# Altium schematic sheet Sheet1.SchDoc
size 431 x 279 mm; SheetNumber: 1; SheetTotal: 1; ENG_APP_DATE: --/--/--; DSN_APP_DATE: --/--/--; CHK_APP_DATE: --/--/--
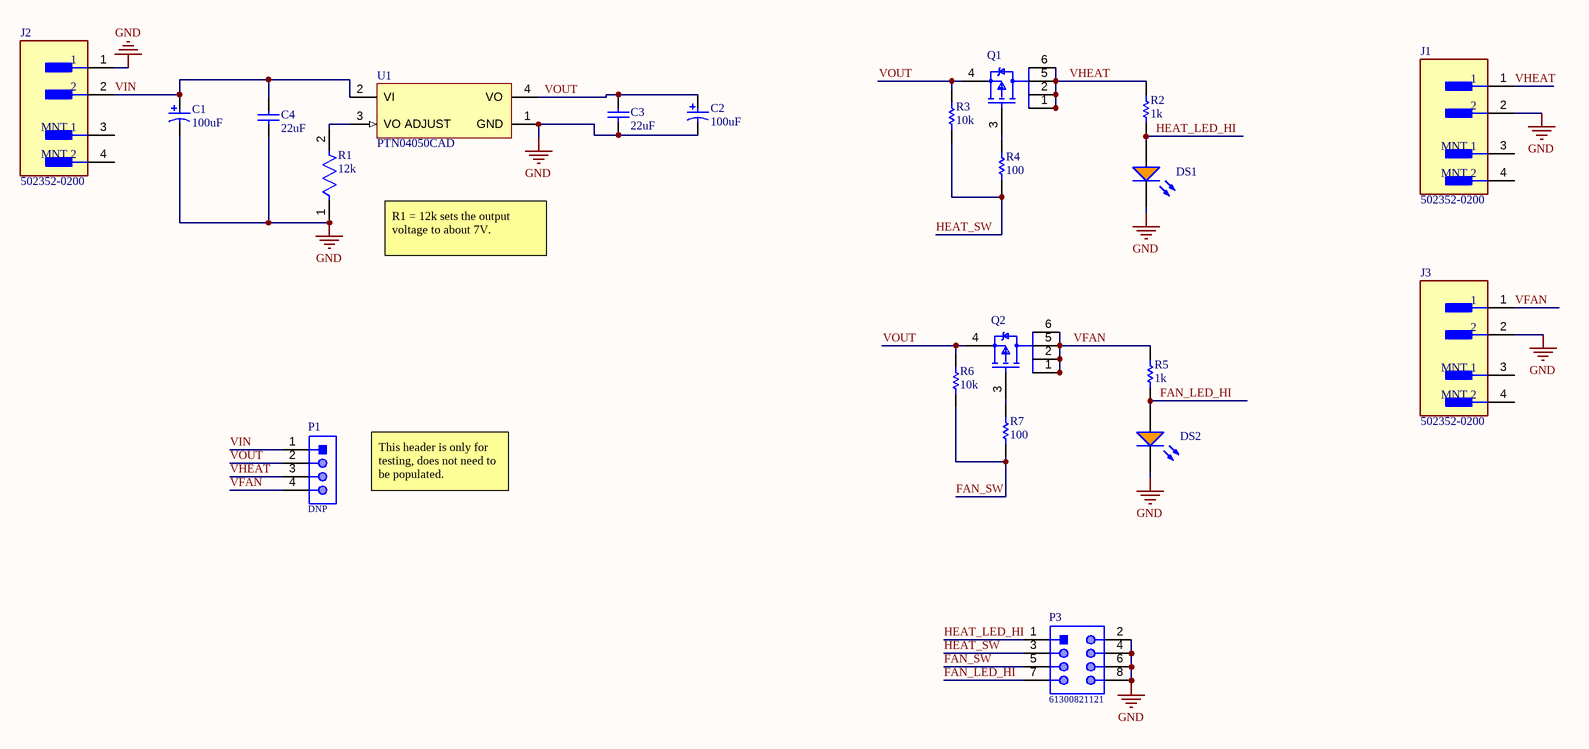
[diagram p0: Sheet1.SchDoc]

## Parts
C1  100uF  [PNSC-FK-V-D8_V]
C2  100uF  [PNSC-FK-V-D8_V]
C3  22uF  [MURA-1210_H_2.7_L]
C4  22uF  [MURA-1210_H_2.7_L]
DS1  HSMD-C170  [AVAG-HSMX-C170_V]  (value not drawn)
DS2  HSMD-C170  [AVAG-HSMX-C170_V]  (value not drawn)
J1  502352-0200  [FP-502352-0200-MFG]
J2  502352-0200  [FP-502352-0200-MFG]
J3  502352-0200  [FP-502352-0200-MFG]
P1  DNP  [61300411121]
P3  61300821121  [61300821121]
Q1  SI3493DDV-T1-GE3  [FP-C-06593-MFG]  (value not drawn)
Q2  SI3493DDV-T1-GE3  [FP-C-06593-MFG]  (value not drawn)
R1  12k  [FP-CRCW0805-e3-IPC_A]
R2  1k  [RESC2013X55X40LL15T20]
R3  10k  [RESC2013X60X35NL10T20]
R4  100  [RESC2013X50X30LL20T20]
R5  1k  [RESC2013X55X40LL15T20]
R6  10k  [RESC2013X60X35NL10T20]
R7  100  [RESC2013X50X30LL20T20]
U1  PTN04050CAD  [EUU0004A]

## Nets
GND: C1.2 C2.2 C3.1 C4.2 DS1.2(K) DS2.2(K) J1.2 J2.1 J3.2 P3.2 P3.4 P3.6 P3.8 R1.1 U1.1(GND)
FAN_LED_HI: DS2.1(A) P3.7 R5.1
FAN_SW: P3.5 R6.2 R7.1
HEAT_LED_HI: DS1.1(A) P3.1 R2.1
HEAT_SW: P3.3 R3.2 R4.1
VFAN: J3.1 P1.4 Q2.1(D) Q2.2(D) Q2.5(D) Q2.6(D) R5.2
VHEAT: J1.1 P1.3 Q1.1(D) Q1.2(D) Q1.5(D) Q1.6(D) R2.2
VIN: C1.1 C4.1 J2.2 P1.1 U1.2(VI)
VOUT: C2.1 C3.2 P1.2 Q1.4(S) Q2.4(S) R3.1 R6.1 U1.4(VO)
NetQ1_3: Q1.3(G) R4.2
NetQ2_3: Q2.3(G) R7.2
NetR1_2: R1.2 U1.3(VO_ADJUST)

Not connected (* = marked no-connect by the designer): J1 3(MNT_1) 4(MNT_2); J2 3(MNT_1) 4(MNT_2); J3 3(MNT_1) 4(MNT_2)

## Notes on the sheet
- R1 = 12k sets the output voltage to about 7V.
- This header is only for testing, does not need to be populated.
- DWG. NO.
- REV.
- SHT.
- THIS DOCUMENT AND THE DATA DISCLOSED HEREIN OR HEREWITH IS THE PROPERTY OF ALTIUM LIMITED AND MAY BE FREELY DISTRIBUTED IN WHOLE. NO RIGHTS ARE RESERVED OR EXPRESS OR IMPLIED WARANTEE GIVEN.
- REVISION
- DESCRIPTION
- DATE
- APPROVED
- ENG:
- APPROVALS
- PROJECT
- DSN:
- CHK:
- REFERENCE DOCUMENTS
- PROJECT REVISION:
- TITLE
- DOCUMENT REVISION:
- DESIGN ITEM:
- BOM:
- FAB DWG:
- PCB DWG:
- ASSY DWG:
- SCALE:
- SIZE
- B
- CAGE CODE
- FILE NAME
- DWG NO.
- SHEET
- OF
- REV

## Library data of the parts
C1 C2 = CMP-2000-06206-1: Aluminum Electrolytic Capacitor, 100 uF, +/- 20%, 25 V, 2-Pin SMD (Size Code D8), -55 to 105 degC, RoHS, Tape and Reel; Manufacturer: Panasonic; Type: Can; Lifetime@Temperature: 2000Hrs@105°C; Capacitance: 100µF; Rated Voltage: 25V; Ripple Current: 280mA; Impedance: 0.34O; Case Size/Dimension: Ø6.3x7.7mm; Operating Temp-Max: 105°C; Series: FK; Package URL: http://industrial.panasonic.com/cdbs/www-data/pdf/RDE0000/DME0000COL48.pdf; Mounting Technology: SurfaceMount; Package Description: 2-Pin Electrolytic Aluminum Capacitor, Body 6.6 x 6.6 mm; Datasheet Version: 03/2016; Datasheet URL: http://industrial.panasonic.com/cdbs/www-data/pdf/RDE0000/ABA0000C1181.pdf; Manufacturer URL: http://www.panasonic.com/; Package Reference: FK-V-D8; Operating Temp Range: -55to+105°C
C3 C4 = CMP-2000-06361-1: Chip Monolithic Ceramic Capacitor, 22 uF, +/- 10%, -55 to 85 degC, 2-Pin SMD (1210), RoHS, Tape and Reel; Manufacturer: Murata; Product Training Modules: High-CapMultilayerCeramicCapacitors; Other Names: 490-1882-2; Online Catalog: GRMSeries; Voltage Rating DC: 16V; Temperature Coefficient: X5R; Capacitance: 22µF; Catalog Drawings: GRMSeries_1210_2.5; Featured Product: GA3SafetyRecognizedCapsandHi-CapMLCC; Applications: GeneralPurpose; Lead Spacing: -; Ratings: -; Standard Package: 1,000; Lead Style: -; Size / Dimension: 0.126"Lx0.098"W(3.20mmx2.50mm); Features: -; Thickness (Max): 0.106"(2.70mm); Package Description: 2-Pin Surface Mount Device, Body 3.2 x 2.5 mm; Series: GRM; Mounting Type: SurfaceMount,MLCC; Category: Capacitors; Package / Case: 1210(3225Metric); Datasheet Version: 05/2014; Datasheet URL: https://datasheet.ciiva.com/26915/getdatasheetpartid-88858-26915376.pdf; Mounting Technology: SurfaceMount; Package Reference: 1210; Tolerance: ±10%; Packaging: Tape&Reel(TR); Operating Temperature: -55°C~85°C; Voltage - Rated: 16V; Height - Seated (Max): -; Family: CeramicCapacitors; Manufacturer URL: http://www.murata.com/
DS1 DS2 = CMP-2000-06421-1: LED Uni-Color Orange, 52 mW, 20 mA, -40 to 85 degC, 2-Pin SMD, RoHS, Tape and Reel; Manufacturer: Avago; Forward Current If Max: 20mA; External Length / Height: 2mm; Luminous Intensity: 8mcd; Lens Shape: Rectangular; Bulb Size: 1.25mmx1.4mm; External Width: 1.25mm; Wavelength Typ: 605nm; Dominant Wavelength: 604nm; PIV Max: 5V; Opto Mounting Orientation: Top; Viewing Angle: 170°; LED Type: Standard; Forward Voltage: 2.2V; SVHC: NoSVHC(19-Dec-2012); No. of Pins: 2; External Depth: 0.8mm; Power Dissipation Pd: 52mW; Storage Temperature Max: 85°C; Package Description: 2-Pin Surface Mount Device, Body 2 x 1.25 mm, Height 0.8 mm; MSL: MSL2A-4weeks; Operating Temperature Range: -30°Cto+85°C; Datasheet URL: http://docs.avagotech.com/docs/AV02-0551EN; Manufacturer URL: http://www.avagotech.com/; Operating Temperature Min: -30°C; Light Area Height: 1.25mm; Mounting Technology: SurfaceMount; Storage Temperature Min: -40°C; LED Mounting: SMD; Peak Wavelength: 605nm; Package / Case: SMD; Peak Forward Current: 20mA; Forward Voltage VF Max: 2.2V; Mounting Type: SMD; LED Colour: Orange; Forward Current If: 20mA; Operating Temperature Max: 85°C; Voltage Vf Typ: 2.2V; Package Reference: HSMX-C170; Datasheet Version: 03/2012; Opto Case Style: SMD; Luminous Intensity Typ: 8mcd
J1 J3 = CMP-04776-000115-1: CONN HEADER SMD R/A 2POS 2MM; Manufacturer: Molex; Number Of Contacts: 2; Current Rating: 3A; Conn Gender: Male; Conn Orientation: Right Angle; Voltage Rating: 125V; Temperature Range Low: -40°C; Ambient Temperature Range High: +105°C; Height: 6.6mm; Pitch: 2mm; Temperature Range High: +105°C; ComponentLink2URL: https://www.molex.com/webdocs/datasheets/pdf/en-us/5023520200_PCB_HEADERS.pdf; Device Class L2: Headers and Wire Housings; Contact Material: Tin,Nickel; Manufacturer Part Number: 502352-0200; Category: Conn; RoHS: TRUE; Ambient Temperature Range Low: -40°C; ComponentLink2Description: Datasheet; Digikey Description: CONN HEADER SMD R/A 2POS 2MM; Package: 502352-0200; Mouser Description: DuraClik™ Wire-to-Board Header, Single Row, Right Angle, 2 Circuits, Tin (Sn); Automotive: No; Lead Free: Yes; Octopart: https://octopart.com/502352-0200-molex-9519058; Number Of Rows: 1; Temperature: -40°C to +105°C; Device Class L1: Connectors; Device Class L3: unset; Footprint Url: https://www.molex.com/pdm_docs/sd/5023520200_sd.pdf
J2 = CMP-04776-000115-1: CONN HEADER SMD R/A 2POS 2MM; Manufacturer: Molex; Number Of Contacts: 2; Current Rating: 3A; Conn Gender: Male; Conn Orientation: Right Angle; Voltage Rating: 125V; System: Connector; Temperature Range Low: -40°C; Ambient Temperature Range High: +105°C; Height: 6.6mm; Pitch: 2mm; Temperature Range High: +105°C; ComponentLink2URL: https://www.molex.com/webdocs/datasheets/pdf/en-us/5023520200_PCB_HEADERS.pdf; Device Class L2: Headers and Wire Housings; Contact Material: Tin,Nickel; Manufacturer Part Number: 502352-0200; Category: Conn; RoHS: TRUE; Ambient Temperature Range Low: -40°C; ComponentLink2Description: Datasheet; Digikey Description: CONN HEADER SMD R/A 2POS 2MM; Package: 502352-0200; Mouser Description: DuraClik™ Wire-to-Board Header, Single Row, Right Angle, 2 Circuits, Tin (Sn); Automotive: No; Lead Free: Yes; Octopart: https://octopart.com/502352-0200-molex-9519058; Number Of Rows: 1; Temperature: -40°C to +105°C; Device Class L1: Connectors; Device Class L3: unset; Footprint Url: https://www.molex.com/pdm_docs/sd/5023520200_sd.pdf
P1 = CMP-1502-01064-1: THT Vertical Pin Header WR-PHD, Pitch 2.54 mm, Single Row, 4 pins; Manufacturer: Wurth Elektronik; Withstanding Voltage: 500VAC; Rated Current: 3A; Working Voltage: 250VAC; Pin Number: 4; Gender: Male; Contact Resistance: 20mOhm; Pitch: 2.54mm; Manufacturer URL: http://www.we-online.de; Operating Temperature: -40to105degC; Packaging: Bag; Mounting Technology: THT; Package Reference: 61300411121; Datasheet URL: https://katalog.we-online.de/em/datasheet/6130xx11121.pdf; Publisher: WurthElektronik; Part Number: 61300411121; Row Number: Single; Orientation: Vertical
P3 = CMP-1502-01078-1: THT Vertical Pin Header WR-PHD, Pitch 2.54 mm, Dual Row, 8 pins; Manufacturer: Wurth Elektronik; Contact Resistance: 20mOhm; Rated Current: 3A; Working Voltage: 250VAC; Pin Number: 8; Withstanding Voltage: 500VAC; Pitch: 2.54mm; Gender: Male; Datasheet URL: https://katalog.we-online.de/em/datasheet/6130xx21121.pdf; Package Reference: 61300821121; Orientation: Vertical; Part Number: 61300821121; Publisher: WurthElektronik; Mounting Technology: THT; Manufacturer URL: http://www.we-online.de; Packaging: Bag; Row Number: Dual; Operating Temperature: -40to105degC
Q1 Q2 = CMP-02550-000156-1: MOSFET P-CHANNEL 20V 8A 6TSOP; Manufacturer: Vishay; Rthja Max: 62.5°C/W; Number Of Channels: 1; Reverse Recovery Time: 21ns; Max Forward Diode Voltage: -1.2V; Threshold Vgs Min: -0.4V; Turn Off Delay Time: 95ns; Input Capacitace At Vds: 1825pF @ -10V; Typ Forward Diode Voltage: -0.8V; Threshold Vgs Max: -1V; Continuous Drain Current: -7.5A; Gate Charge At Vgs: 34.8nC @ -8V; Depletion Mode: False; Drain To Source Breakdown Voltage: -20V; Pulse Drain Current: -32A; Reverse Recovery Charge: 34.8nC; Transconductance: 30S; Max Junction Temp: +150°C; Standoff Height: 0.01mm; Drain To Source Resistance: 0.02Ω; Power Dissipation: 2W; Turn On Delay Time: 25ns; Gate To Source Voltage: 8V; Device Class L2: Transistors; Footprint Url: https://www.vishay.com/docs/71200/71200.pdf; Category: Trans; Automotive: No; Digikey Description: MOSFET P-CHANNEL 20V 8A 6TSOP; Manufacturer Part Number: SI3493DDV-T1-GE3; Lead Free: Yes; Octopart: https://octopart.com/si3493ddv-t1-ge3-vishay-81014282; Temperature: -55°C to +150°C; ComponentLink2Description: Datasheet; Device Class L1: Discrete Semiconductors; Temperature Range High: +150°C; RoHS: TRUE; Number Of P Channels: 1; Device Class L3: MOSFETs; Height: 1.1mm; Temperature Range Low: -55°C; Package: C-06593; ComponentLink2URL: https://www.vishay.com/docs/74735/si3493ddv.pdf; Drain To Source Voltage: -20V
R1 = CMP-2001-04934-2: RES Thick Film, 12kΩ, 1%, 0.125W, 100ppm/°C, 0805; Power Rating: 125mW; Voltage Rating (DC): 150V; Resistance: 12kR; Height: 0.45mm; Temperature Coefficient: 100ppm/°C; Min Operating Temperature: -55°C; Case/Package: 0805; Case Code (Imperial): 0805; Contact Plating: Tin; Tolerance: 1%; Weight: 0.000194oz; Max Operating Temperature: 155°C; Features: Automotive AEC-Q200; Mount: Surface Mount; Composition: Thick Film; Max Power Dissipation: 125mW; Number of Terminations: 2; Military Standard: Not; Package Quantity: 10; Width: 0.049inch; Lead Free: Lead Free; Length: 2mm; Depth: 1.25mm; Packaging: Tape and Reel; Radiation Hardening: No; Case Code (Metric): 2012; Voltage Rating: 150V; Termination: SMD/SMT
R2 R5 = CMP-2001-04738-1: TNPW08051K00BEEN; Manufacturer: Vishay Dale; Part Number: TNPW08051K00BEEN
R3 R6 = CMP-1659-00013-4: Chip Resistor, 10 KOhm, +/- 1%, 0.125 W, -55 to 155 degC, 0805 (2012 Metric), RoHS, Tape and Reel; Manufacturer: Yageo; Voltage Rating: 150 V; Mount: Surface Mount; ComponentLink1Description: Manufacturer URL; ComponentLink2URL: http://www.yageo.com/documents/recent/PYu-RC_Group_51_RoHS_L_04.pdf; Pins: 2; Length: 2 mm; Min Operating Temperature: -55 degC; Height: 0.5 mm; Mounting Technology: Surface Mount; RoHSCompliant: true; REACH SVHC: No SVHC; ComponentLink1URL: http://www.yageo.com/; Max Operating Temperature: 155 degC; PackageReference: 0805; DatasheetVersion: Rev. 4, 02/2016; Package Quantity: 5000; Packaging: Tape and Reel; ComponentLink2Description: Datasheet; PackageDescription: 2-Pin Surface Mounted Device, Body 2 x 1.25 mm
R4 R7 = CMP-2001-04901-1: Manufacturer: Vishay Dale; Part Number: CRCW0805100RFKEA
U1 = CMP-0387-00658-2: 12 W, 3.3 / 5 V Input, Wide Adjust Output Boost Converter, -40 to 85 degC, 4-pin Module (EUU4), Pb-Free (RoHS); Manufacturer: Texas Instruments; Vin(Min)(V): 2.95; VO Adjustable: TRUE; Vin(Max)(V): 5.5; Iout(Max)(A): 2.4; Regulated Outputs(#): 1; Vout(Min)(V): 5; Vout(Max)(V): 15; SubFamily: Non-Isolated POL; ComponentLink1URL: http://www.ti.com/; ComponentLink3URL: http://www.ti.com/litv/pdf/mpds218a; ComponentLink1Description: Manufacturer URL; ComponentLink3Description: Package Specification; Eco-Plan: Pb-Free (RoHS); ComponentLink4Description: URL Link1; PackageDescription: 4-Pin Plastic Special Shape, Body 12.57 x 22.1 mm; PartNumber: PTN04050CAD; DatasheetVersion: SLTS251A; Mounting Technology: Through Hole; PackageReference: EUU0004A; PackageVersion: 4205246-2/C; ComponentLink2Description: Datasheet; ComponentLink2URL: http://www.ti.com/general/docs/lit/getliterature.tsp?genericPartNumber=PTN04050C&fileType=pdf; ComponentLink4URL: Samples URL:http://www.ti.com/product/ptn04050c#samples